# Altium project tester1.PrjPcb (part 1 of 3)
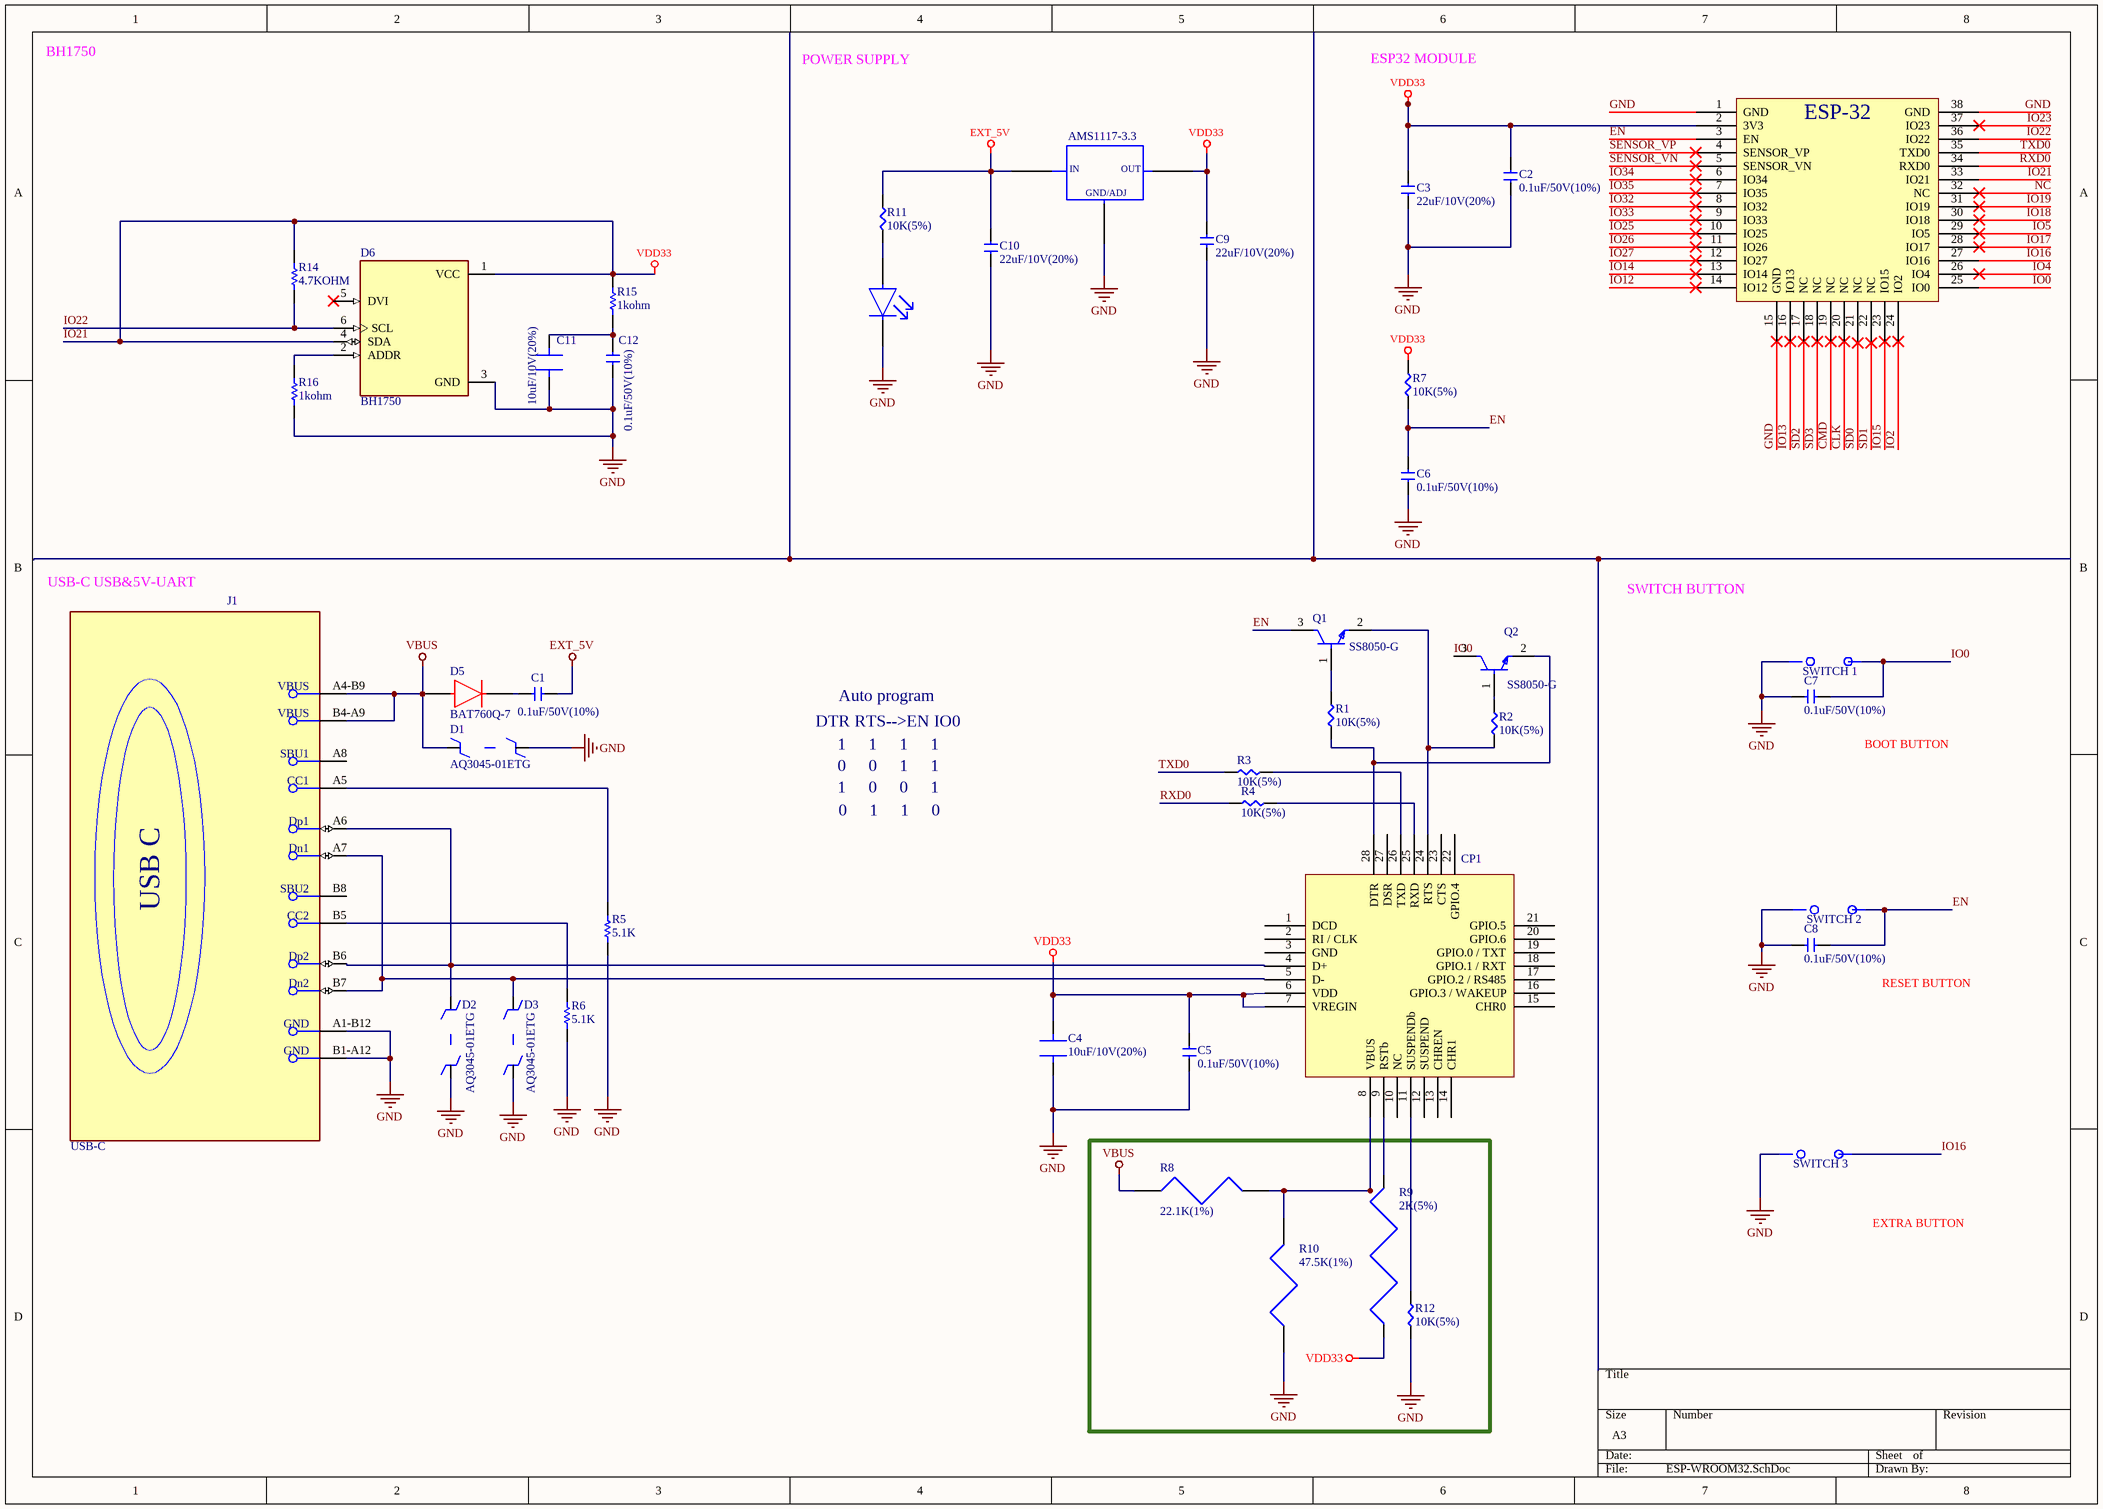
[diagram p0: ESP-WROOM32.SchDoc]
1 sheet, 42 parts. Net scope: global (net labels, ports and power ports of the same name join across sheets).
Board file: ESP-WROOM32.PcbDoc

## Sheet ESP-WROOM32.SchDoc
size A3; SheetNumber: 1; SheetTotal: 1

### Parts
*1  ESP32-WROOM-32E-N4  [MODULE_ESP-WROOM-32]  (value not drawn)
C1  0.1uF/50V(10%)  [FP-GRM158-0_2-IPC_A]
C2  0.1uF/50V(10%)  [FP-GRM158-0_2-IPC_A]
C3  22uF/10V(20%)  [FP-GRM158-0_2-IPC_A]
C4  10uF/10V(20%)  [FP-GRM158-0_2-IPC_A]
C5  0.1uF/50V(10%)  [FP-GRM158-0_2-IPC_A]
C6  0.1uF/50V(10%)  [FP-GRM158-0_2-IPC_A]
C7  0.1uF/50V(10%)  [FP-GRM158-0_2-IPC_A]
C8  0.1uF/50V(10%)  [FP-GRM158-0_2-IPC_A]
C9  22uF/10V(20%)  [FP-GRM158-0_2-IPC_A]
C10  22uF/10V(20%)  [FP-GRM158-0_2-IPC_A]
C11  10uF/10V(20%)  [FP-GRM158-0_2-IPC_A]
C12  0.1uF/50V(10%)  [FP-GRM158-0_2-IPC_A]
CP1  CP2102N-A02-GQFN28  [FP-CP2102N-A02-GQFN28-IPC_A]  (value not drawn)
D1  AQ3045-01ETG  [PESD5V0U1BA,115]
D2  AQ3045-01ETG  [PESD5V0U1BA,115]
D3  AQ3045-01ETG  [PESD5V0U1BA,115]
D4  LTST-C170GKT  [FP-LTST-C170GKT-MFG]  (value not drawn)
D5  BAT760Q-7  [BAT760Q-7]
D6  BH1750  [XDCR_BH1750FVI-TR]
J1  USB-C  [FP-2171790001-MFG]
Q1  SS8050-G  [FP-SS8050-G-IPC_A]
Q2  SS8050-G  [FP-SS8050-G-IPC_A]
R1  10K(5%)  [RESC1005X40X25LL05T10]
R2  10K(5%)  [RESC1005X40X25LL05T10]
R3  10K(5%)  [RESC1005X40X25LL05T10]
R4  10K(5%)  [RESC1005X40X25LL05T10]
R5  5.1K  [RESC1005X40X25LL05T10]
R6  5.1K  [RESC1005X40X25LL05T10]
R7  10K(5%)  [RESC1005X40X25LL05T10]
R8  22.1K(1%)  [RESC1005X40X25LL05T10]
R9  2K(5%)  [RESC1005X40X25LL05T10]
R10  47.5K(1%)  [RESC1005X40X25LL05T10]
R11  10K(5%)  [RESC1005X40X25LL05T10]
R12  10K(5%)  [RESC1005X40X25LL05T10]
R14  4.7KOHM  [RESC1005X40X25LL05T10]
R15  1kohm  [RESC1005X40X25LL05T10]
R16  1kohm  [RESC1005X40X25LL05T10]
SWITCH_1  PTS645SL50SMTR92LFS  [FP-PTS645SH50SMTR92LFS-MFG]  (value not drawn)
SWITCH_2  PTS645SL50SMTR92LFS  [FP-PTS645SH50SMTR92LFS-MFG]  (value not drawn)
SWITCH_3  PTS645SL50SMTR92LFS  [FP-PTS645SH50SMTR92LFS-MFG]  (value not drawn)
U1  AMS1117-3.3  [FP-AMS1117-IPC_A]

### Nets
EXT_5V: C1.2 C10.2 R11.2 U1.1
GND: *1.1(GND) *1.15(GND) *1.38(GND) C2.1 C3.1 C4.1 C5.1 C6.1 C7.1 C8.1 C9.1 C10.1 C11.1 C12.1 D1.2 D2.2 D3.2 D4.2 D6.3(GND) J1.A1-B12(GND) J1.B1-A12(GND) R5.1 R6.1 R10.1 R12.1 R16.1 SWITCH_1.4 SWITCH_2.4 SWITCH_3.4 U1.3
IO21: *1.2(3V3) *1.33(IO21) C2.2 C3.2 C4.2 C5.2 C9.2 CP1.6(VDD) CP1.7(VREGIN) D6.1(VCC) D6.4(SDA) R7.2 R9.1 R14.1 R15.2 U1.2  [also labelled VDD33]
VBUS: D1.1 D5.1 J1.A4-B9(VBUS) J1.B4-A9(VBUS) R8.1
CLK: *1.20(NC)
CMD: *1.19(NC)
EN: *1.3(EN) C6.2 C8.2 Q1.3(C) R7.1 SWITCH_2.3
IO0: *1.25(IO0) C7.2 Q2.3(C) SWITCH_1.3
IO2: *1.24(IO2)
IO4: *1.26(IO4)
IO5: *1.29(IO5)
IO12: *1.14(IO12)
IO13: *1.16(IO13)
IO14: *1.13(IO14)
IO15: *1.23(IO15)
IO16: *1.27(IO16) SWITCH_3.3
IO17: *1.28(IO17)
IO18: *1.30(IO18)
IO19: *1.31(IO19)
IO22: *1.36(IO22) D6.6(SCL) R14.2
IO23: *1.37(IO23)
IO25: *1.10(IO25)
IO26: *1.11(IO26)
IO27: *1.12(IO27)
IO32: *1.8(IO32)
IO33: *1.9(IO33)
IO34: *1.6(IO34)
IO35: *1.7(IO35)
NC: *1.32(NC)
RXD0: *1.34(RXD0) R4.1
SD0: *1.21(NC)
SD1: *1.22(NC)
SD2: *1.17(NC)
SD3: *1.18(NC)
SENSOR_VN: *1.5(SENSOR_VN)
SENSOR_VP: *1.4(SENSOR_VP)
TXD0: *1.35(TXD0) R3.1
NetC1_1: C1.1 D5.2
NetC11_2: C11.2 C12.2 R15.1
NetCP1_4: CP1.4(D+) D2.1 J1.A6(Dp1) J1.B6(Dp2)
NetCP1_5: CP1.5(D-) D3.1 J1.A7(Dn1) J1.B7(Dn2)
NetCP1_8: CP1.8(VBUS) R8.2 R10.2
NetCP1_9: CP1.9(RSTb) R9.2
NetCP1_11: CP1.11(SUSPENDb) R12.2
NetCP1_24: CP1.24(RTS) Q1.2(E) R2.1
NetCP1_25: CP1.25(RXD) R4.2
NetCP1_26: CP1.26(TXD) R3.2
NetCP1_28: CP1.28(DTR) Q2.2(E) R1.1
NetD4_1: D4.1 R11.1
NetD6_2: D6.2(ADDR) R16.2
NetJ1_A5: J1.A5(CC1) R5.2
NetJ1_B5: J1.B5(CC2) R6.2
NetQ1_1: Q1.1(B) R1.2
NetQ2_1: Q2.1(B) R2.2

Not connected (* = marked no-connect by the designer): CP1 1(DCD) 2(RI_/_CLK) 3(GND) 10(NC) 12(SUSPEND) 13(CHREN) 14(CHR1) 15(CHR0) 16(GPIO.3_/_WAKEUP) 17(GPIO.2_/_RS485) 18(GPIO.1_/_RXT) 19(GPIO.0_/_TXT) 20(GPIO.6) 21(GPIO.5) 22(GPIO.4) 23(CTS) 27(DSR); D6 5(DVI)*; J1 A8(SBU1) B8(SBU2)

### Notes on the sheet
- BH1750
- POWER SUPPLY
- ESP32 MODULE
- USB-C USB&5V-UART
- SWITCH BUTTON
- Auto program
- DTR RTS-->EN IO0
- 1     1     1     1
- 0     0     1     1
- BOOT BUTTON
- 1     0     0     1
- 0     1     1     0
- RESET BUTTON
- EXTRA BUTTON
- (in symbol 2171790001) USB C
- (in symbol AMS1117-3.3) IN; OUT; GND/ADJ
- (in symbol ESP32-WROOM-32E-N4) ESP-32